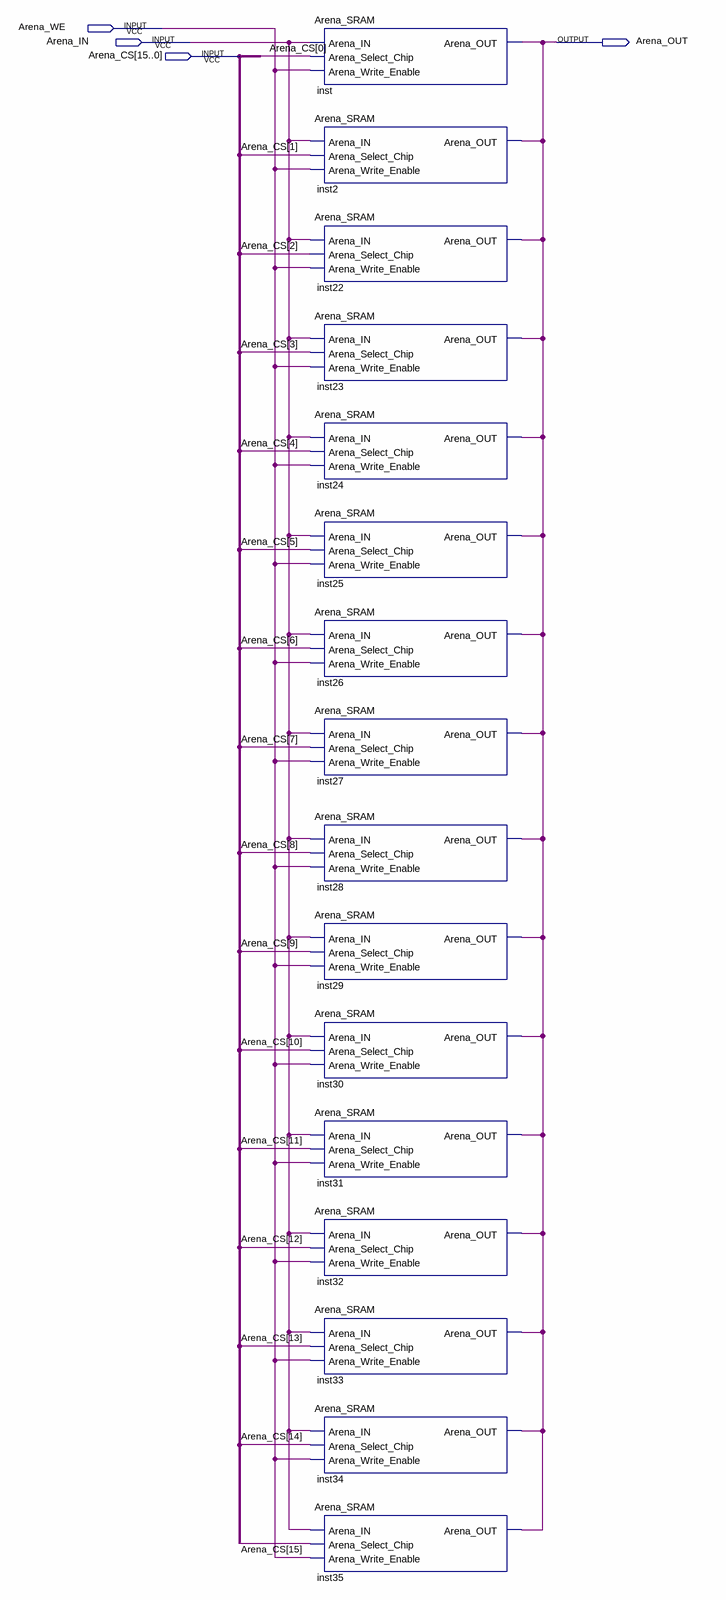
[diagram p0: schematic sheet]
// Quartus schematic Arena_16x1_SRAM.bdf as structural Verilog: 16 symbols, 4 pins
module Arena_16x1_SRAM (
  input  Arena_WE,
  input  Arena_IN,
  input  [15:0] Arena_CS,
  output Arena_OUT
);

  Arena_SRAM inst (
    .Arena_IN(Arena_IN), .Arena_Select_Chip(Arena_CS[0]), .Arena_Write_Enable(Arena_WE), .Arena_OUT(Arena_OUT));
  Arena_SRAM inst2 (
    .Arena_IN(Arena_IN), .Arena_Select_Chip(Arena_CS[1]), .Arena_Write_Enable(Arena_WE), .Arena_OUT(Arena_OUT));
  Arena_SRAM inst22 (
    .Arena_IN(Arena_IN), .Arena_Select_Chip(Arena_CS[2]), .Arena_Write_Enable(Arena_WE), .Arena_OUT(Arena_OUT));
  Arena_SRAM inst23 (
    .Arena_IN(Arena_IN), .Arena_Select_Chip(Arena_CS[3]), .Arena_Write_Enable(Arena_WE), .Arena_OUT(Arena_OUT));
  Arena_SRAM inst24 (
    .Arena_IN(Arena_IN), .Arena_Select_Chip(Arena_CS[4]), .Arena_Write_Enable(Arena_WE), .Arena_OUT(Arena_OUT));
  Arena_SRAM inst25 (
    .Arena_IN(Arena_IN), .Arena_Select_Chip(Arena_CS[5]), .Arena_Write_Enable(Arena_WE), .Arena_OUT(Arena_OUT));
  Arena_SRAM inst26 (
    .Arena_IN(Arena_IN), .Arena_Select_Chip(Arena_CS[6]), .Arena_Write_Enable(Arena_WE), .Arena_OUT(Arena_OUT));
  Arena_SRAM inst27 (
    .Arena_IN(Arena_IN), .Arena_Select_Chip(Arena_CS[7]), .Arena_Write_Enable(Arena_WE), .Arena_OUT(Arena_OUT));
  Arena_SRAM inst28 (
    .Arena_IN(Arena_IN), .Arena_Select_Chip(Arena_CS[8]), .Arena_Write_Enable(Arena_WE), .Arena_OUT(Arena_OUT));
  Arena_SRAM inst29 (
    .Arena_IN(Arena_IN), .Arena_Select_Chip(Arena_CS[9]), .Arena_Write_Enable(Arena_WE), .Arena_OUT(Arena_OUT));
  Arena_SRAM inst30 (
    .Arena_IN(Arena_IN), .Arena_Select_Chip(Arena_CS[10]), .Arena_Write_Enable(Arena_WE),
    .Arena_OUT(Arena_OUT));
  Arena_SRAM inst31 (
    .Arena_IN(Arena_IN), .Arena_Select_Chip(Arena_CS[11]), .Arena_Write_Enable(Arena_WE),
    .Arena_OUT(Arena_OUT));
  Arena_SRAM inst32 (
    .Arena_IN(Arena_IN), .Arena_Select_Chip(Arena_CS[12]), .Arena_Write_Enable(Arena_WE),
    .Arena_OUT(Arena_OUT));
  Arena_SRAM inst33 (
    .Arena_IN(Arena_IN), .Arena_Select_Chip(Arena_CS[13]), .Arena_Write_Enable(Arena_WE),
    .Arena_OUT(Arena_OUT));
  Arena_SRAM inst34 (
    .Arena_IN(Arena_IN), .Arena_Select_Chip(Arena_CS[14]), .Arena_Write_Enable(Arena_WE),
    .Arena_OUT(Arena_OUT));
  Arena_SRAM inst35 (
    .Arena_IN(Arena_IN), .Arena_Select_Chip(Arena_CS[15]), .Arena_Write_Enable(Arena_WE),
    .Arena_OUT(Arena_OUT));
endmodule
